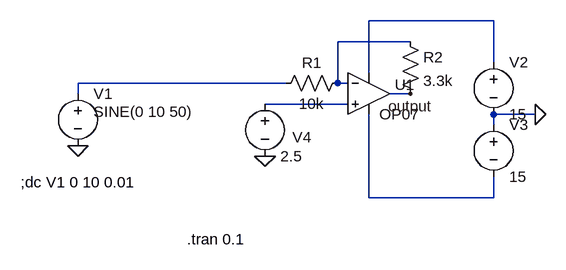
[diagram p0: schematic Draft02.asc]
Draft02.asc, the LTspice schematic file:
Version 4
SHEET 1 880 680
WIRE 608 -16 416 -16
WIRE 480 16 368 16
WIRE 608 48 608 -16
WIRE 416 64 416 -16
WIRE 288 80 -32 80
WIRE 368 80 368 16
WIRE 384 80 368 80
WIRE -32 96 -32 80
WIRE 480 96 448 96
WIRE 384 112 256 112
WIRE 672 128 608 128
WIRE 608 144 608 128
WIRE 416 256 416 128
WIRE 608 256 608 224
WIRE 608 256 416 256
FLAG -32 176 0
FLAG 672 128 0
FLAG 480 96 output
FLAG 256 192 0
SYMBOL voltage -32 80 R0
WINDOW 123 0 0 Left 0
WINDOW 39 0 0 Left 0
WINDOW 3 24 44 Left 2
SYMATTR InstName V1
SYMATTR Value SINE(0 10 50)
SYMBOL OpAmps\\OP07 416 32 R0
WINDOW 0 40 50 Left 2
SYMATTR InstName U1
SYMBOL voltage 608 32 R0
WINDOW 123 0 0 Left 0
WINDOW 39 0 0 Left 0
SYMATTR InstName V2
SYMATTR Value 15
SYMBOL voltage 608 128 R0
WINDOW 123 0 0 Left 0
WINDOW 39 0 0 Left 0
SYMATTR InstName V3
SYMATTR Value 15
SYMBOL res 384 64 R90
WINDOW 0 0 56 VBottom 2
WINDOW 3 32 56 VTop 2
SYMATTR InstName R1
SYMATTR Value 10k
SYMBOL res 464 0 R0
SYMATTR InstName R2
SYMATTR Value 3.3k
SYMBOL voltage 256 96 R0
WINDOW 0 42 67 Left 2
WINDOW 123 0 0 Left 0
WINDOW 39 0 0 Left 0
SYMATTR InstName V4
SYMATTR Value 2.5
TEXT -120 232 Left 2 !;dc V1 0 10 0.01
TEXT 136 320 Left 2 !.tran 0.1

The netlist it stands for:
* Draft02.asc
V1 N003 0 SINE(0 10 50)
XU1 N004 N002 N001 N005 output LT1001  ; OP07, pins In+ In- V+ V- OUT
V2 N001 0 15
V3 0 N005 15
R1 N002 N003 10k
R2 N002 output 3.3k
V4 N004 0 2.5
;dc V1 0 10 0.01
.tran 0.1
.lib LTC.lib
.backanno
.end